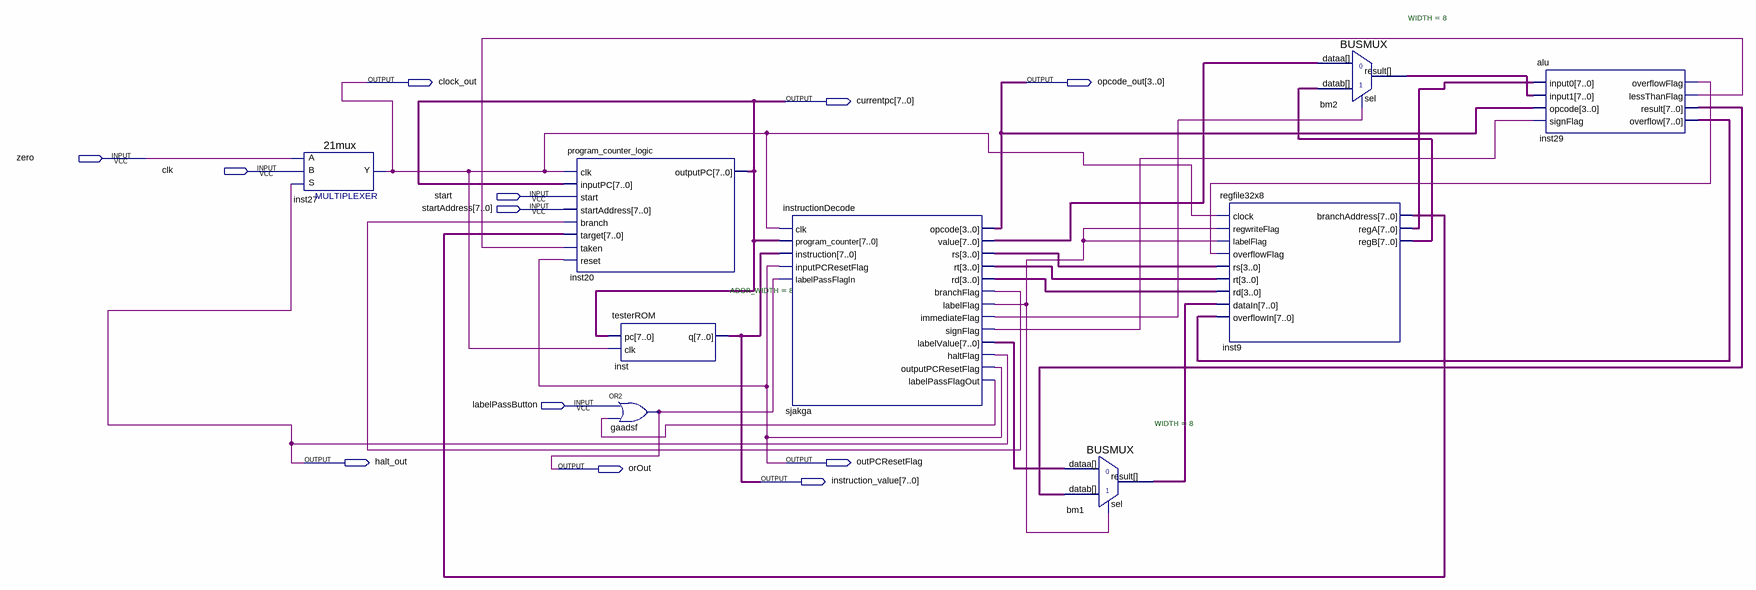
[diagram p0: schematic sheet]
// Quartus schematic CS141L.bdf as structural Verilog: 9 symbols, 12 pins
module CS141L (
  input  zero,
  input  clk,
  input  start,
  input  [7:0] startAddress,
  input  labelPassButton,
  output clock_out,
  output [3:0] opcode_out,
  output [7:0] currentpc,
  output halt_out,
  output outPCResetFlag,
  output orOut,
  output [7:0] instruction_value
);

  wire inst29_lessthanflag, inst29_overflowflag, sjakga_branchflag, sjakga_immediateflag, sjakga_labelflag,
       sjakga_labelpassflagout, sjakga_signflag;
  wire [3:0] sjakga_rd, sjakga_rs, sjakga_rt;
  wire [7:0] bm1_result, bm2_result, inst9_branchaddress, inst9_rega, inst9_regb, inst29_overflow,
       inst29_result, sjakga_labelvalue, sjakga_value;

  \21mux  inst27 (.S(halt_out), .B(clk), .A(zero), .Y(clock_out));
  program_counter_logic inst20 (
    .clk(clock_out), .inputPC(currentpc), .start(start), .startAddress(startAddress),
    .branch(sjakga_branchflag), .target(inst9_branchaddress), .taken(inst29_lessthanflag),
    .reset(outPCResetFlag), .outputPC(currentpc));
  testerROM #(.ADDR_WIDTH(8)) inst (.pc(currentpc), .clk(clock_out), .q(instruction_value));
  or gaadsf (orOut, labelPassButton, sjakga_labelpassflagout);
  instructionDecode sjakga (
    .clk(clock_out), .program_counter(currentpc), .instruction(instruction_value),
    .inputPCResetFlag(outPCResetFlag), .labelPassFlagIn(orOut), .opcode(opcode_out), .value(sjakga_value),
    .rs(sjakga_rs), .rt(sjakga_rt), .rd(sjakga_rd), .branchFlag(sjakga_branchflag),
    .labelFlag(sjakga_labelflag), .immediateFlag(sjakga_immediateflag), .signFlag(sjakga_signflag),
    .labelValue(sjakga_labelvalue), .haltFlag(halt_out), .outputPCResetFlag(outPCResetFlag),
    .labelPassFlagOut(sjakga_labelpassflagout));
  BUSMUX #(.WIDTH(8)) bm1 (
    .datab(inst29_result), .sel(sjakga_labelflag), .dataa(sjakga_labelvalue), .result(bm1_result));
  regfile32x8 inst9 (
    .clock(clock_out), .regwriteFlag(sjakga_labelflag), .labelFlag(sjakga_labelflag),
    .overflowFlag(inst29_overflowflag), .rs(sjakga_rs), .rt(sjakga_rt), .rd(sjakga_rd), .dataIn(bm1_result),
    .overflowIn(inst29_overflow), .branchAddress(inst9_branchaddress), .regA(inst9_rega), .regB(inst9_regb));
  BUSMUX #(.WIDTH(8)) bm2 (.datab(inst9_regb), .sel(sjakga_immediateflag), .dataa(sjakga_value), .result(bm2_result));
  alu inst29 (
    .input0(inst9_rega), .input1(bm2_result), .opcode(opcode_out), .signFlag(sjakga_signflag),
    .overflowFlag(inst29_overflowflag), .lessThanFlag(inst29_lessthanflag), .result(inst29_result),
    .overflow(inst29_overflow));
endmodule
